# Altium project Archer.PrjPCB
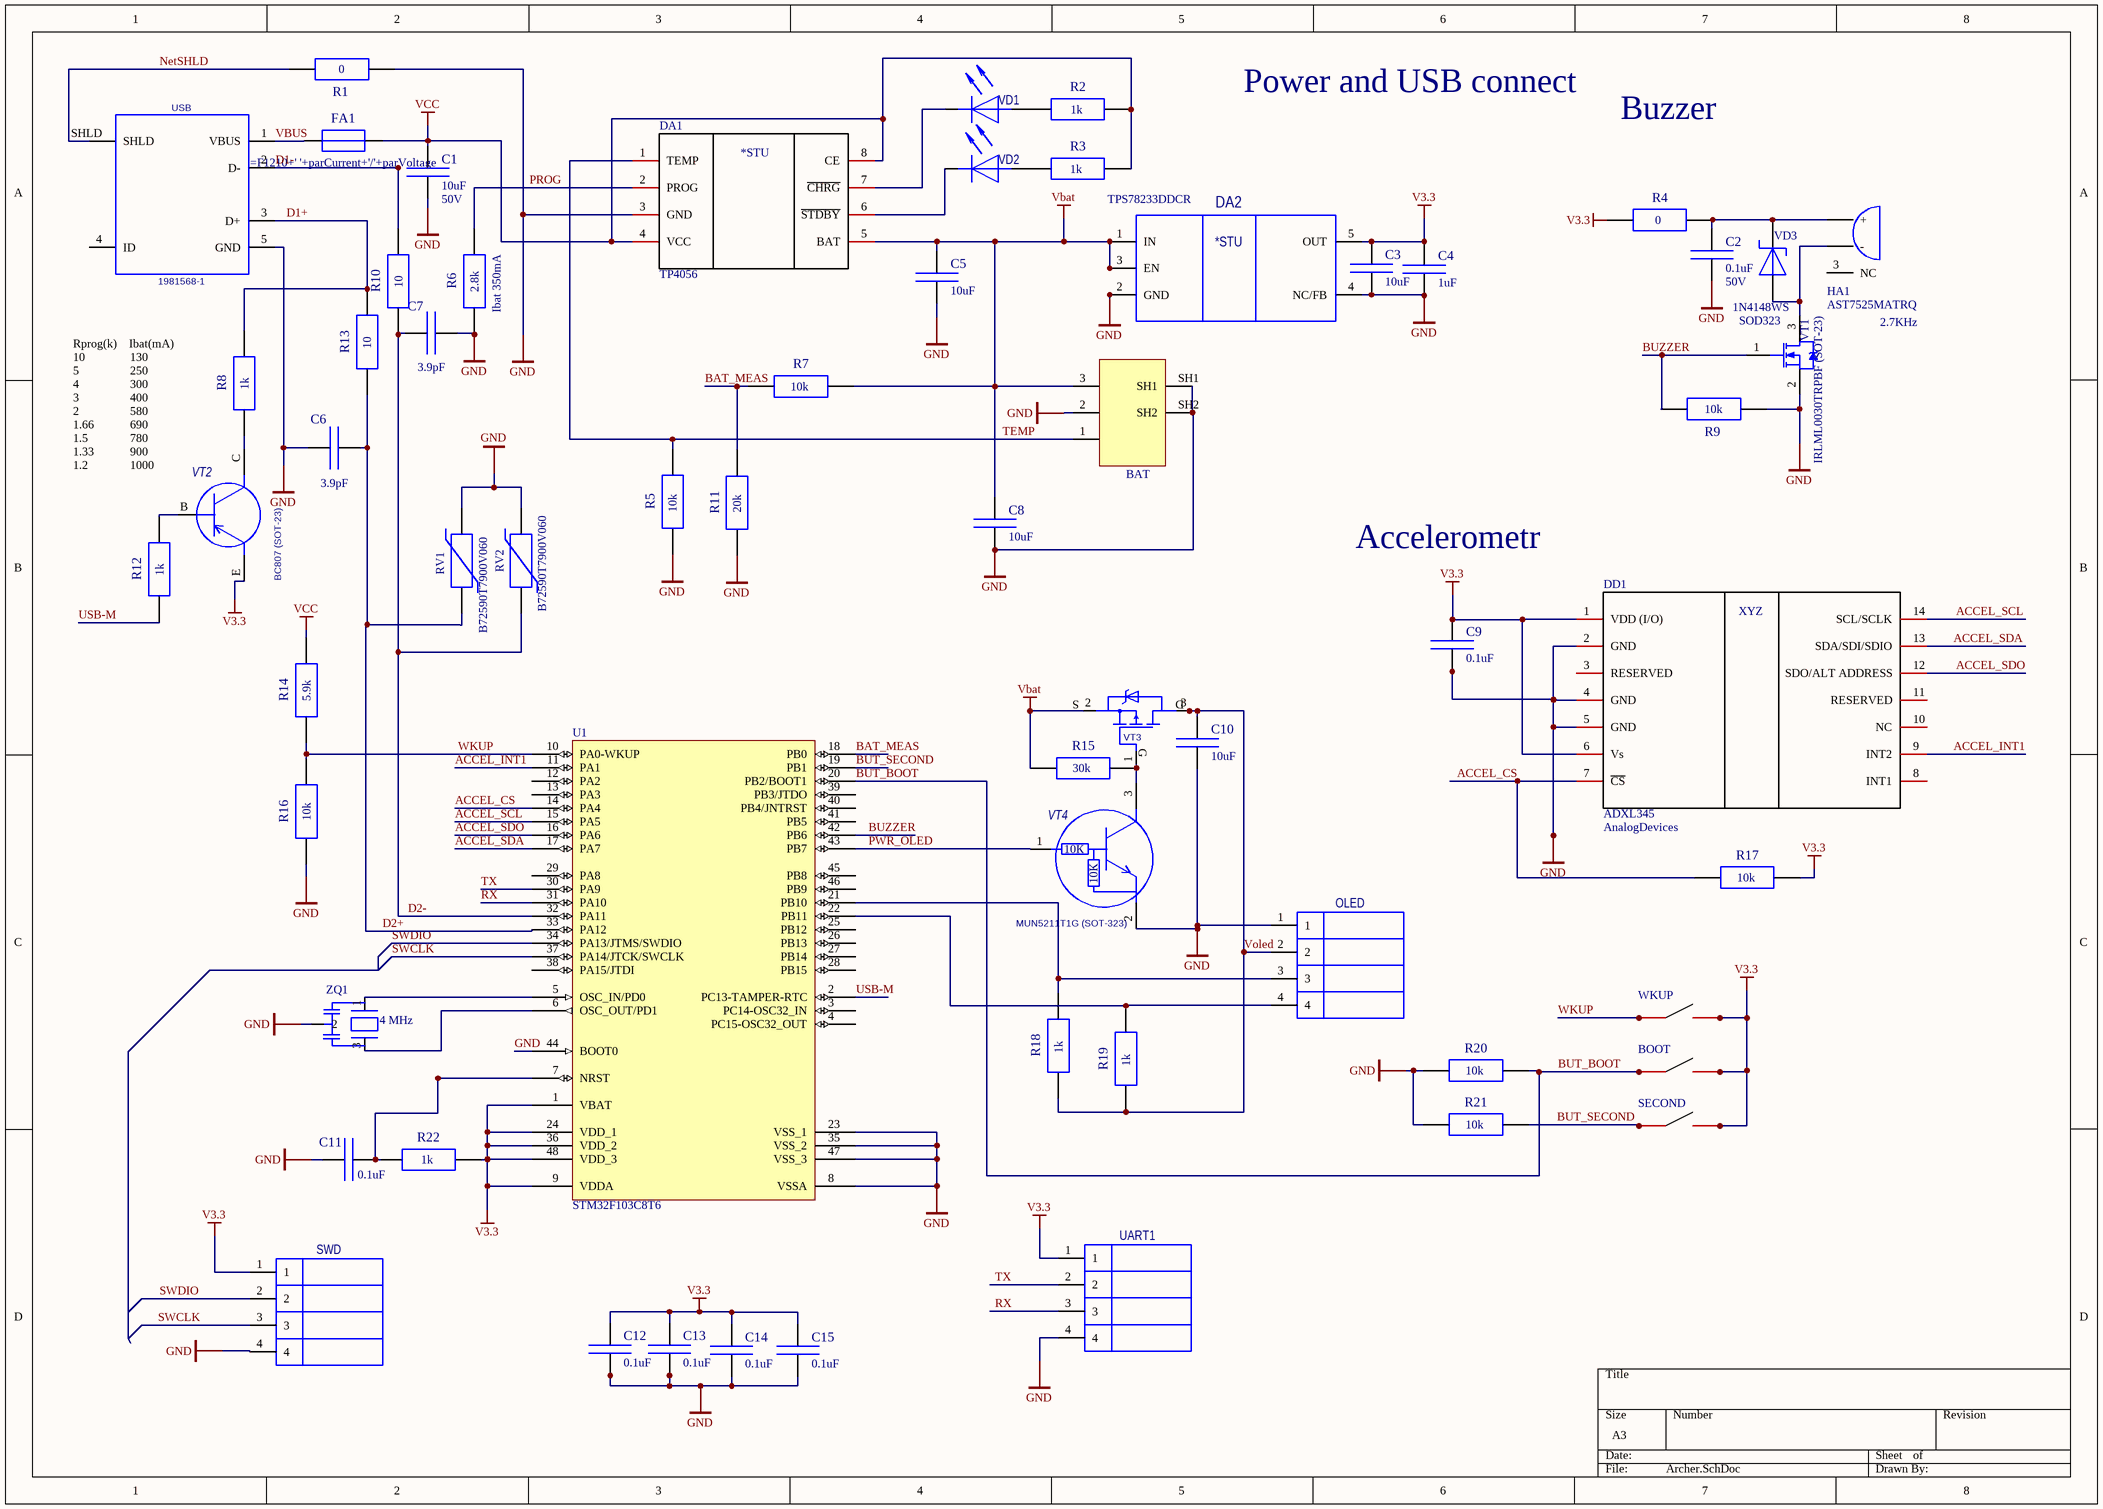
[diagram p0: Archer.SchDoc]
1 sheet, 61 parts. Net scope: global (net labels, ports and power ports of the same name join across sheets).
Board file: Archer.PcbDoc

## Sheet Archer.SchDoc
size A3

### Parts
BAT  Hirose DF13A-3P-1.25H(20)  [DF13A-3P-1.25H]  (value not drawn)
BOOT  (no value)  [Button Switronic Industrial 0650HIM-130G-G high]
C1  value 10uF  parVoltage: 50V  [CAPC3216X135(1206)]  (hidden comment: чип 1206 10uF/50V,)
C2  value 0.1uF  parVoltage: 50V  [CAPC1608X50(0603)]  (hidden comment: чип 0603 0.1uF/50V,)
C3  value 10uF  [CAPC3216X135(1206)]  (hidden comment: чип 1206 10uF/50V,)
C4  value 1uF  [CAPC1608X50(0603)]  (hidden comment: чип 0603 1uF/50V,)
C5  value 10uF  [CAPC3216X135(1206)]  (hidden comment: чип 1206 10uF/50V,)
C6  value 3.9pF  [CAPC1608X50(0603)]  (hidden comment: чип 0603 3.9pF/50V,)
C7  value 3.9pF  [CAPC1608X50(0603)]  (hidden comment: чип 0603 3.9pF/50V,)
C8  value 10uF  [CAPC3216X135(1206)]  (hidden comment: чип 1206 10uF/50V,)
C9  value 0.1uF  [CAPC1608X50(0603)]  (hidden comment: чип 0603 0.1uF/50V,)
C10  value 10uF  [CAPC2012X135(0805)]  (hidden comment: чип 0805 10uF/50V,)
C11  value 0.1uF  [CAPC1608X50(0603)]  (hidden comment: чип 0603 0.1uF/50V,)
C12  value 0.1uF  [CAPC1608X50(0603)]  (hidden comment: чип 0603 0.1uF/50V,)
C13  value 0.1uF  [CAPC1608X50(0603)]  (hidden comment: чип 0603 0.1uF/50V,)
C14  value 0.1uF  [CAPC1608X50(0603)]  (hidden comment: чип 0603 0.1uF/50V,)
C15  value 0.1uF  [CAPC1608X50(0603)]  (hidden comment: чип 0603 0.1uF/50V,)
DA1  Model name: TP4056  [Microchip NanJing Linear Battery Charger TP4056 SOP-8]
DA2  cmpPartNum: TPS78233DDCR  [SOT95P285X130-5N(SOT23-5)]  (hidden comment: TPS78233DDCR(SOT23-5))
DD1  Model name: ADXL345  Factory: AnalogDevices  [Microchip DigitalAccelerometer AnalogDevices ADXL345 LGA-14]
FA1  (no value)  [RESC1210N]
HA1  AST7525MATRQ  Примечание: 2.7KHz  [AST7525MATRQ]
OLED  DS1021-1x4  [HDRV4P254_1x4]  (value not drawn)
R1  value 0  [RESC1608X45(0603)]  (hidden comment: чип 0603 0 5%)
R2  value 1k  [RESC1608X45(0603)]  (hidden comment: чип 0603 1k 5%)
R3  value 1k  [RESC1608X45(0603)]  (hidden comment: чип 0603 1k 5%)
R4  value 0  [RESC1608X45(0603)]  (hidden comment: чип 0603 0 5%)
R5  value 10k  [RESC1608X45(0603)]  (hidden comment: чип 0603 10k 5%)
R6  value 2.8k  [RESC1608X45(0603)]  (hidden comment: чип 0603 2.8k 5%)
R7  value 10k  [RESC1608X45(0603)]  (hidden comment: чип 0603 10k 5%)
R8  value 1k  [RESC1608X45(0603)]  (hidden comment: чип 0603 1k 5%)
R9  value 10k  [RESC1608X45(0603)]  (hidden comment: чип 0603 10k 5%)
R10  value 10  [RESC1608X45(0603)]  (hidden comment: чип 0603 10 5%)
R11  value 20k  [RESC1608X45(0603)]  (hidden comment: чип 0603 20k 5%)
R12  value 1k  [RESC1608X45(0603)]  (hidden comment: чип 0603 1k 5%)
R13  value 10  [RESC1608X45(0603)]  (hidden comment: чип 0603 10 5%)
R14  value 5.9k  [RESC1608X45(0603)]  (hidden comment: чип 0603 5.9k 5%)
R15  value 30k  [RESC1608X45(0603)]  (hidden comment: чип 0603 30k 5%)
R16  value 10k  [RESC1608X45(0603)]  (hidden comment: чип 0603 10k 5%)
R17  value 10k  [RESC1608X45(0603)]  (hidden comment: чип 0603 10k 5%)
R18  value 1k  [RESC1608X45(0603)]  (hidden comment: чип 0603 1k 5%)
R19  value 1k  [RESC1608X45(0603)]  (hidden comment: чип 0603 1k 5%)
R20  value 10k  [RESC1608X45(0603)]  (hidden comment: чип 0603 10k 5%)
R21  value 10k  [RESC1608X45(0603)]  (hidden comment: чип 0603 10k 5%)
R22  value 1k  [RESC1608X45(0603)]  (hidden comment: чип 0603 1k 5%)
RV1  B72590T7900V060  [RESC1005X35(0402)]
RV2  B72590T7900V060  [RESC1005X35(0402)]
SECOND  (no value)  [Button Switronic Industrial 0650HIM-130G-G high]
SWD  DS1021-1x4  [HDRV4P254_1x4]  (value not drawn)
U1  STM32F103C8T6  [LQFP48_N]
UART1  DS1021-1x4  [HDRV4P254_1x4]  (value not drawn)
USB  1981568-1  [USB MICRO-B]
VD1  чип 0603 LED (RED)  [LEDC1608X80N(0603)_red]  (value not drawn)
VD2  чип 0603 LED (RED)  [LEDC1608X80N(0603)_red]  (value not drawn)
VD3  cmpPkg: SOD323  cmpPartNum: 1N4148WS  [SOD2514X110N(SOD323)]  (hidden comment: 1N4148WS (SOD323))
VT1  IRLML0030TRPBF (SOT-23)  [SOT95P230-3N (SOT-23) num]
VT2  BC807 (SOT-23)  [SOT95P230-3N (SOT-23)]
VT3  IRLML6402TRPBF (SOT-23)  [SOT95P230-3N (SOT-23) num]  (value not drawn)
VT4  MUN5211T1G (SOT-323)  parR1value: 10К  [SOT65P200X110-3N (SOT323)_NUM]
WKUP  (no value)  [Button Switronic Industrial 0650HIM-130G-G high]
ZQ1  value 4 MHz  [XTAL450X200X120 (CSTCR)]  (hidden comment: CSTCR4M00G53Z-B0(4 MHz))

### Nets
GND: BAT.2 BAT.SH1 BAT.SH2 C1.2 C2.1 C3.2 C4.1 C5.2 C6.2 C7.1 C8.2 C9.1 C10.1(P1) C11.2 C12.1 C13.1 C14.1 C15.1 DA1.3(GND) DA2.2(GND) DA2.4(NC/FB) DD1.2(GND) DD1.4(GND) DD1.5(GND) OLED.1 R1.1 R5.1 R6.1 R9.1 R11.1 R16.1 R20.1 R21.1 RV1.1 RV2.1 SWD.4 U1.8(VSSA) U1.23(VSS_1) U1.35(VSS_2) U1.44(BOOT0) U1.47(VSS_3) UART1.4 USB.5(GND) VT1.2(S) VT4.2(E) ZQ1.2
V3.3: BOOT.3 BOOT.4 C3.1 C4.2 C9.2 C12.2 C13.2 C14.2 C15.2 DA2.5(OUT) DD1.1(VDD_(I/O)) DD1.6(Vs) R4.1 R17.2 R22.2 SECOND.3 SECOND.4 SWD.1 U1.1(VBAT) U1.9(VDDA) U1.24(VDD_1) U1.36(VDD_2) U1.48(VDD_3) UART1.1 VT2.E WKUP.3 WKUP.4
Vbat: BAT.3 C5.1 C8.1 DA1.5(BAT) DA2.1(IN) DA2.3(EN) R7.2 R15.1 VT3.2(S)
VCC: C1.1 DA1.4(VCC) DA1.8(CE) FA1.2 R2.2 R3.2 R14.2
ACCEL_CS: DD1.7(~{CS}) R17.1 U1.14(PA4)
ACCEL_INT1: DD1.9(INT2) U1.11(PA1)
ACCEL_SCL: DD1.14(SCL/SCLK) U1.15(PA5)
ACCEL_SDA: DD1.13(SDA/SDI/SDIO) U1.17(PA7)
ACCEL_SDO: DD1.12(SDO/ALT_ADDRESS) U1.16(PA6)
BAT_MEAS: R7.1 R11.2 U1.18(PB0)
BUT_BOOT: BOOT.1 BOOT.2 R20.2 U1.20(PB2/BOOT1)
BUT_SECOND: R21.2 SECOND.1 SECOND.2 U1.19(PB1)
BUZZER: R9.2 U1.42(PB6) VT1.1(G)
D1+: R8.2 R13.2 USB.3(D+)
D1-: R10.2 USB.2(D-)
D2+: C6.1 R13.1 RV1.2 U1.33(PA12)
D2-: C7.2 R10.1 RV2.2 U1.32(PA11)
NetSHLD: R1.2 USB.SHLD
PROG: DA1.2(PROG) R6.2
PWR_OLED: U1.43(PB7) VT4.1(B)
RX: U1.31(PA10) UART1.3
SWCLK: SWD.3 U1.37(PA14/JTCK/SWCLK)
SWDIO: SWD.2 U1.34(PA13/JTMS/SWDIO)
TEMP: BAT.1 DA1.1(TEMP) R5.2
TX: U1.30(PA9) UART1.2
USB-M: R12.1 U1.2(PC13-TAMPER-RTC)
VBUS: FA1.1 USB.1(VBUS)
Voled: C10.2(P2) OLED.2 R18.1 R19.1 VT3.3(D)
WKUP: R14.1 R16.2 U1.10(PA0-WKUP) WKUP.1 WKUP.2
NetC2_2: C2.2 HA1.1(+) R4.2 VD3.C
NetC11_1: C11.1 R22.1 U1.7(NRST)
NetDA1_6: DA1.6(~{STDBY}) VD2.C(cathode)
NetDA1_7: DA1.7(~{CHRG}) VD1.C(cathode)
NetHA1_2: HA1.2(-) VD3.A VT1.3(D)
NetOLED_3: OLED.3 R18.2 U1.21(PB10)
NetOLED_4: OLED.4 R19.2 U1.22(PB11)
NetR2_1: R2.1 VD1.A(anod)
NetR3_1: R3.1 VD2.A(anod)
NetR8_1: R8.1 VT2.C
NetR12_2: R12.2 VT2.B
NetR15_2: R15.2 VT3.1(G) VT4.3(C)
NetU1_5: U1.5(OSC_IN/PD0) ZQ1.1
NetU1_6: U1.6(OSC_OUT/PD1) ZQ1.3

Not connected (* = marked no-connect by the designer): DD1 3(RESERVED) 8(INT1) 10(NC) 11(RESERVED); HA1 3(NC); U1 3(PC14-OSC32_IN) 4(PC15-OSC32_OUT) 12(PA2) 13(PA3) 25(PB12) 26(PB13) 27(PB14) 28(PB15) 29(PA8) 38(PA15/JTDI) 39(PB3/JTDO) 40(PB4/JNTRST) 41(PB5) 45(PB8) 46(PB9); USB 4(ID)

### Notes on the sheet
- Power and USB connect
- Buzzer
- (near R6) Ibat 350mA
- (near VT2) Rprog(k)    Ibat(mA)
  10               130
  5                 250
  4                 300
  3                 400
  2                 580
  1.66            690
  1.5              780
  1.33            900
  1.2              1000
- Accelerometr
- (in symbol Microchip DigitalAccelerometer AnalogDevices ADXL345 LGA-14) XYZ
- (in symbol Microchip NanJing Linear Battery Charger TP4056 SOP-8) *STU
- (in symbol TPS76333DBV) *STU

### Library data of the parts
BAT = DF13C-3P-1.25_(**): Crimping Connector 3p; parType: SMD, RA; cmpCategory: Industrial; cmpPinCount: 3; cmpPitch: 1.25mm; Category: Разъем; Примечание: *; cmpPartNum: DF13A-3P-1.25H(20); cmpManufacturer: Hirose; cmpDescription: =cmpManufacturer+' '+cmpPartNumber+', '+cmpPitch+' pitch,'+cmpPinCount+' pins, '+parType
BOOT SECOND WKUP = Button Switronic Industrial 0650HIM-130G-G high: Кнопка тактовая без фиксации; Step size: 4.5 мм; Value: no; Shop link: http://www.chipdip.ru/product/0650him-130g-g-tc-0103-ts-a2ps-130/; Price: chipdip.ru 25 руб; Component type: Button Clock; Package: 0650; Factory: Switronic Industrial; Model name: 0650HIM-130G-G
C1 = C1206: cmpDescription: чип 1206 10uF *, 50V, ,; Tolerance: *; Category: Конденсатор; Примечание: *; cmpPkg: чип 1206
C2 = C0603: cmpDescription: чип 0603 0.1uF , 50V, ,; Category: Конденсатор; cmpPkg: чип 0603
C3 C5 C8 = C1206: cmpDescription: чип 1206 10uF *, 50V, ,; parVoltage: 50V; Tolerance: *; Category: Конденсатор; Примечание: *; cmpPkg: чип 1206
C4 = C0603: cmpDescription: чип 0603 1uF , 50V, ,; parVoltage: 50V; Category: Конденсатор; cmpPkg: чип 0603
C6 C7 = C0603: cmpDescription: чип 0603 3.9pF , 50V, ,; parVoltage: 50V; Category: Конденсатор; cmpPkg: чип 0603
C9 C11-C15 = C0603: cmpDescription: чип 0603 0.1uF , 50V, ,; parVoltage: 50V; Category: Конденсатор; cmpPkg: чип 0603
C10 = C0805: cmpDescription: чип 0805 10uF , 50V, ,; parVoltage: 50V; Category: Конденсатор; cmpPkg: чип 0805
DA1 = Microchip NanJing Linear Battery Charger TP4056 SOP-8: DESCRIPTION  The TP4056 is a complete constant-current/constant-voltage linear charger for single cell  lithium-ion batteries. Its SOP package and low external component count make the TP4056  ideally suited for portable applications. Furthermore, the TP4056 can work within USB and wall  adapter.; Factory: NanJing Top Power ASIC Corp; Component type: Microchip Linear Battery Charger; Package: SOP-8
DA2 = TPS76333DBV: cmpManufacturer: TI; parOTemp: -40°C to 125°C; cmpDescription: TI TPS78233DDCR (SOT23-5), -40°C to 125°C; Category: Микросхема; cmpPkg: SOT23-5
DD1 = Microchip DigitalAccelerometer AnalogDevices ADXL345 LGA-14: GENERAL DESCRIPTION  The ADXL345 is a small, thin, ultralow power, 3-axis accelerometer  with high resolution (13-bit) measurement at up to ±16 g. Digital  output data is formatted as 16-bit twos complement and is accessible through either a SPI (3- or 4-wire) or I2C digital interface.; Component type: DigitalAccelerometer; Package: LGA-14
FA1 = FUSE 1210: cmpDescription: , Предохранитель чип 1210 2A,; cmpPkg: чип 1210; parCurrent: 2A; Category: Предохранитель; Примечание: *; Tolerance: *
HA1 = AST7525MATRQ: Transducer (Electro-Mech); cmpPartNum: AST7525MATRQ; Category: Прибор звуковой сигнализации; cmpDescription: AST7525MATRQ
OLED SWD UART1 = Header-2.54P-4N: IDC разъем 4 контактов. Шаг 2.54мм; cmpManufacturer: Connfly; parType: Straight; cmpDescription: Connfly DS1021-1x4, Header 2.54мм pitch,4 pins, Straight; cmpPinCount: 4; cmpType: Header; Category: Разъем; cmpPartNum: DS1021-1x4; cmpPitch: 2.54мм
R1 R4 = R0603: cmpDescription: чип 0603 0 5%, 100 мВт, ,; parPwr: 100 мВт; Category: Резистор; cmpPkg: чип 0603; Tolerance: 5%
R2 R3 R8 R12 R18 R19 R22 = R0603: cmpDescription: чип 0603 1k 5%, 100 мВт, ,; parPwr: 100 мВт; Category: Резистор; cmpPkg: чип 0603; Tolerance: 5%
R5 R7 R9 R16 R17 R20 R21 = R0603: cmpDescription: чип 0603 10k 5%, 100 мВт, ,; parPwr: 100 мВт; Category: Резистор; cmpPkg: чип 0603; Tolerance: 5%
R6 = R0603: cmpDescription: чип 0603 2.8k 5%, 100 мВт, ,; parPwr: 100 мВт; Category: Резистор; cmpPkg: чип 0603; Tolerance: 5%
R10 R13 = R0603: cmpDescription: чип 0603 10 5%, 100 мВт, ,; parPwr: 100 мВт; Category: Резистор; cmpPkg: чип 0603; Tolerance: 5%
R11 = R0603: cmpDescription: чип 0603 20k 5%, 100 мВт, ,; parPwr: 100 мВт; Category: Резистор; cmpPkg: чип 0603; Tolerance: 5%
R14 = R0603: cmpDescription: чип 0603 5.9k 5%, 100 мВт, ,; parPwr: 100 мВт; Category: Резистор; cmpPkg: чип 0603; Tolerance: 5%
R15 = R0603: cmpDescription: чип 0603 30k 5%, 100 мВт, ,; parPwr: 100 мВт; Category: Резистор; cmpPkg: чип 0603; Tolerance: 5%
U1 = STM32F103C8T6: STM32 ARM-based 32-bit MCU with 64 Kbytes Flash, 48-pin LQFP, Industrial Temperature; Published: 30-May-2008; DatasheetVersion: rev6, Mar-2008; PackageVersion: Mar-2008; PackageReference: LQFP48; Publisher: Altium Limited; PackageDescription: 48-Pin Low-Profile Quad Flat Pack, 7 x 7 mm Body, 0.5 mm Pitch (LQFP48); ComponentLink1Description: Manufacturer Link; ComponentLink1URL: www.st.com/stm32; ComponentLink2Description: Datasheet; ComponentLink2URL: http://www.st.com/stonline/products/literature/ds/13587.pdf
USB = USB Micro-B Tyco: USB micro type A. SMT (TE 1981568-1); cmpManufacturer: TE Connectivity; parType: RA, SMT; cmpCategory: Industrial; cmpDescription: TE Connectivity 1981568-1 USB Micro B, RA, SMT; cmpType: USB Micro B; Value: *; Category: Разъем; cmpPartNum: 1981568-1; Supplier 1: Mouser; Supplier 2: Arrow; Supplier 3: Digi-Key; Supplier Part Number 1: 571-1981568-1; Supplier Part Number 2: 48480482S8827272N5665; Supplier Part Number 3: A97800CT-ND
VD1 VD2 = LED 0603: cmpDescription: LED 0603, LED RED, чип 0603; parLvTyp: xxмкд; parPd: ххмВт; parVf: хВ; Примечание: *; Category: Диод; cmpPkg: чип 0603; cmpPartNum: LED 0603; parColor: RED; cmpType: LED
VD3 = BAT54WS: parFCurrent: 150mА; parPwr: хххмВт; parVoltage: хххВ; cmpType: SS diode; cmpDescription: 1N4148WS, SS diode, 150mА, хххВ, SOD323; Примечание: *; Category: Диод
VT1 = IRLML0030: HEXFET Power MOSFET; cmpManufacturer: IR; parOTemp: -55°C to 150°C; parCurrent: 5.3А; parRds: 40мОм; parVgs: ±20В; cmpType: N-Channel mosfet; parVds: 30В; cmpDescription: IRLML0030TRPBF, N-Channel mosfet, Vds=30В, Vgs=±20В, 5.3А, 40мОм, SOT-23; cmpPkg: SOT-23; cmpPartNum: IRLML0030TRPBF; category: Транзистор
VT2 = BC807: cmpManufacturer: NXP; Title: Транзистор; parOTemp: -65°C to 150°C; parCurrent: 100мА; parHfe: 100-600; parVce: -45В; cmpType: PNP; cmpDescription: BC807, PNP, -45В, 100мА, hfe=100-600, SOT-23; Category: Транзистор; cmpPkg: SOT-23; cmpPartNum: BC807
VT3 = IRLML6402: cmpManufacturer: International Rectifier; parVds: -20В; parOTemp: -55°C to 150°C; parCurrent: -3.7А; parRDs: 65мОм; parVgs: 12В; cmpType: P-Channel Mosfet; cmpDescription: IRLML6402TRPBF, P-Channel Mosfet, Vds=-20В, Vgs=12В, -3.7А, 65мОм, SOT-23; Category: Транзистор; cmpPkg: SOT-23; cmpPartNum: IRLML6402TRPBF
VT4 = MUN5211T1G: MUN5211T1; cmpManufacturer: ON Semiconductor; Title: Транзистор; parHfe: 35-60; parOTemp: -55°C to 150°C; parCurrent: 0.1А; parVce: 50В; cmpType: NPN General; cmpDescription: MUN5211T1G, NPN General, 50В, 0.1А, hfe=35-60, SOT-323; Category: Транзистор; cmpPkg: SOT-323; cmpPartNum: MUN5211T1G; parR2value: 10К
ZQ1 = XTAL, SMD, 4.5mm x 2mm, 3 pads: CSTCR_G15C Ceramic Resonators; cmpManufacturer: Murata; cmpPkg: SMD, 4.5x2.0 mm; Tolerance: ±0.5%; parCload: BuiltIN cap; cmpDescription: Murata CSTCR4M00G53Z-B0, (4 MHz±0.5%), BuiltIN cap, -40°C to 125°C; parOTemp: -40°C to 125°C; Category: Кварцевый Резонатор; cmpPartNum: CSTCR4M00G53Z-B0
RV1 RV2 = B72590T7900V060: Category: Варистор; Value: B72590T7900V060